# Altium schematic sheet kr3.SchDoc
size 420 x 297 mm; SheetNumber: 1; SheetTotal: 1
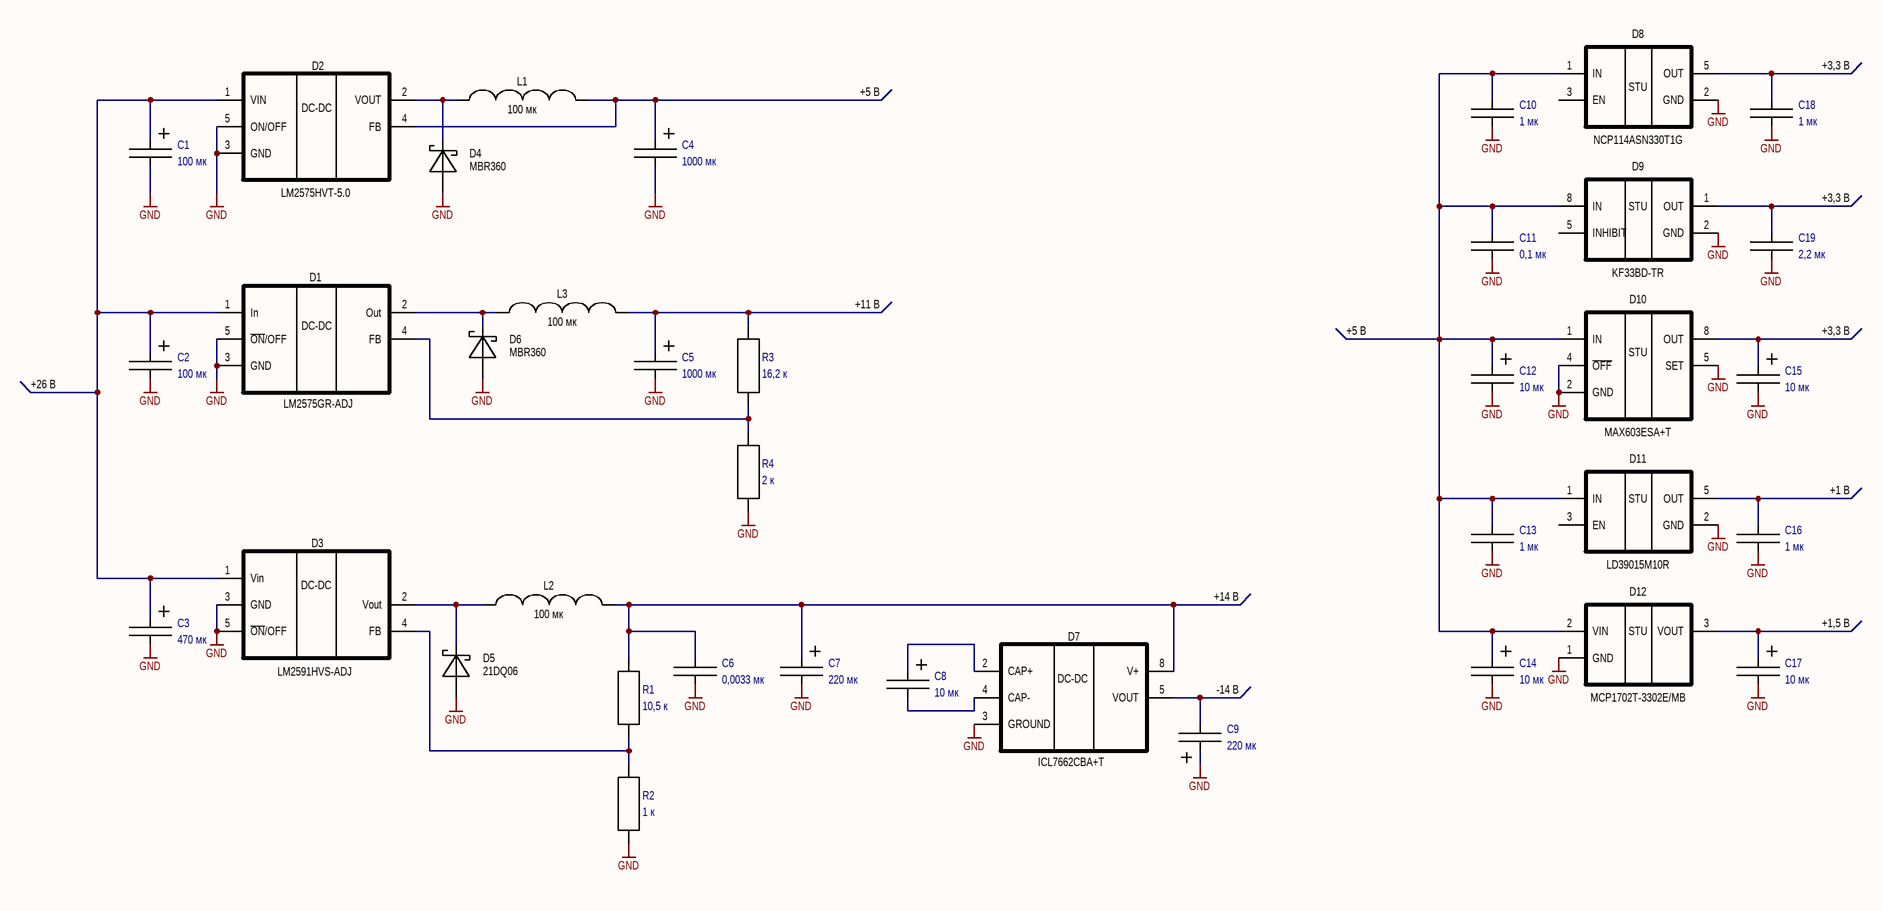
[diagram p0: kr3.SchDoc]

## Parts
C1  value 100 мк  (hidden comment: 100 мкФ ±* * * *, *)
C2  value 100 мк  (hidden comment: 100 мкФ ±* * * *, *)
C3  value 470 мк  (hidden comment: 470 мкФ ±* * * *, *)
C4  value 1000 мк  (hidden comment: 1000 мкФ ±* * * *, *)
C5  value 1000 мк  (hidden comment: 1000 мкФ ±* * * *, *)
C6  value 0,0033 мк  (hidden comment: 0,0033 мкФ ±* * * *, *)
C7  value 220 мк  (hidden comment: 220 мкФ ±* * * *, *)
C8  value 10 мк  (hidden comment: 10 мкФ ±* * * *, *)
C9  value 220 мк  (hidden comment: 220 мкФ ±* * * *, *)
C10  value 1 мк  (hidden comment: 1 мкФ ±* * * *, *)
C11  value 0,1 мк  (hidden comment: 0,1 мкФ ±* * * *, *)
C12  value 10 мк  (hidden comment: 10 мкФ ±* * * *, *)
C13  value 1 мк  (hidden comment: 1 мкФ ±* * * *, *)
C14  value 10 мк  (hidden comment: 10 мкФ ±* * * *, *)
C15  value 10 мк  (hidden comment: 10 мкФ ±* * * *, *)
C16  value 1 мк  (hidden comment: 1 мкФ ±* * * *, *)
C17  value 10 мк  (hidden comment: 10 мкФ ±* * * *, *)
C18  value 1 мк  (hidden comment: 1 мкФ ±* * * *, *)
C19  value 2,2 мк  (hidden comment: 2,2 мкФ ±* * * *, *)
D1  LM2575GR-ADJ
D2  LM2575HVT-5.0
D3  LM2591HVS-ADJ
D4  MBR360
D5  21DQ06
D6  MBR360
D7  ICL7662CBA+T
D8  NCP114ASN330T1G
D9  KF33BD-TR
D10  MAX603ESA+T
D11  LD39015M10R
D12  MCP1702T-3302E/MB
L1  100 мк
L2  100 мк
L3  100 мк
R1  value 10,5 к
R2  value 1 к
R3  value 16,2 к
R4  value 2 к

## Nets
GND: C1.2 C2.2 C3.2 C4.2 C5.2 C6.2 C7.2 C9.1 C10.2 C11.2 C12.2 C13.2 C14.2 C15.2 C16.2 C17.2 C18.2 C19.2 D1.3(GND) D1.5(~{ON}/OFF) D2.3(GND) D2.5(ON/OFF) D3.3(GND) D3.5(~{ON}/OFF) D4.1(A) D5.1(A) D6.1(A) D7.3(GROUND) D8.2(GND) D9.2(GND) D10.2(GND) D10.4(~{OFF}) D10.5(SET) D11.2(GND) D12.1(GND) R2.2 R4.2
NetC1_1: C1.1 C2.1 C3.1 D1.1(In) D2.1(VIN) D3.1(Vin)
NetC4_1: C4.1 D2.4(FB)
NetC5_1: C5.1 R3.1
NetC6_1: C6.1 C7.1 D7.8(V+) R1.1
NetC8_1: C8.1 D7.2(CAP+)
NetC8_2: C8.2 D7.4(CAP-)
NetC9_2: C9.2 D7.5(VOUT)
NetC10_1: C10.1 C11.1 C12.1 C13.1 C14.1 D8.1(IN) D9.8(IN) D10.1(IN) D11.1(IN) D12.2(VIN)
NetC15_1: C15.1 D10.8(OUT)
NetC16_1: C16.1 D11.5(OUT)
NetC17_1: C17.1 D12.3(VOUT)
NetC18_1: C18.1 D8.5(OUT)
NetC19_1: C19.1 D9.1(OUT)
NetD1_2: D1.2(Out) D6.1(C)
NetD1_4: D1.4(FB) R3.2 R4.1
NetD2_2: D2.2(VOUT) D4.1(C)
NetD3_2: D3.2(Vout) D5.1(C)
NetD3_4: D3.4(FB) R1.2 R2.1

Not connected (* = marked no-connect by the designer): D8 3(EN); D9 5(INHIBIT); D11 3(EN)

## Notes on the sheet
- +5 В
- +3,3 В
- +11 В
- +26 В
- +1 В
- +14 В
- +1,5 В
- (near C9) -14 В
- Перв.примен.
- Справ. №
- Подп. и дата
- Инв.№ дубл.
- Взам. инв. №
- Изм.
- Лист
- № докум.
- Подп.
- Дата
- Лит.
- Масса
- Масштаб
- Пров.
- Т.контр
- Разраб.
- Схема электрическая принципиальная
- 1
- Листов
- Инв № подл.
- Н.контр.
- Утв.
- Копировал
- Формат А3
- (in symbol ICL7662CBA+T) DC-DC
- (in symbol KF33BD-TR) STU
- (in symbol LD39015M10R) STU
- (in symbol LM2575GR-ADJ) DC-DC
- (in symbol LM2575HVT-5.0) DC-DC
- (in symbol LM2591HVS-ADJ) DC-DC
- (in symbol MAX603ESA+T) STU
- (in symbol MCP1702T-3302E/MB) STU
- (in symbol NCP114ASN330T1G) STU

## Library data of the parts
C1-C5 C7-C9 C12 C14 C15 C17 = C+: Company: *; Tolerance: *; Voltage: *; Type: *; PartNumber: *; Package: *
C6 C10 C11 C13 C16 C18 C19 = C: Company: *; PartNumber: *; Tolerance: *; Voltage: *; Type: *; Package: *
D5 = MBR360
L1-L3 = Inductor Sumida
R1-R4 = R: Company: *; PartNumber: *; Package: *; Tolerance: *